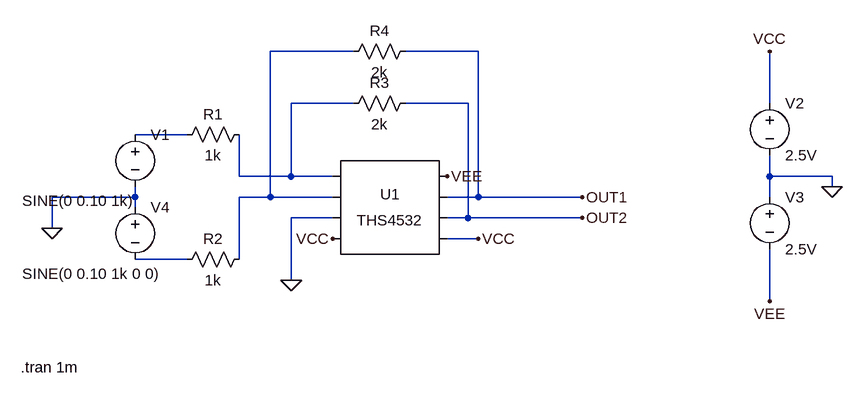
[diagram p0: schematic THS4532_test.asc]
THS4532_test.asc, the LTspice schematic file:
Version 4
SHEET 1 880 680
WIRE 112 -64 -16 -64
WIRE 304 -64 192 -64
WIRE 112 16 16 16
WIRE 288 16 192 16
WIRE 752 16 752 -64
WIRE -144 64 -224 64
WIRE -64 128 -64 64
WIRE 16 128 16 16
WIRE 16 128 -64 128
WIRE 80 128 16 128
WIRE 752 128 752 96
WIRE 848 128 752 128
WIRE 848 144 848 128
WIRE -224 160 -224 144
WIRE -224 160 -352 160
WIRE -16 160 -16 -64
WIRE -16 160 -64 160
WIRE 80 160 -16 160
WIRE 304 160 304 -64
WIRE 304 160 256 160
WIRE 464 160 304 160
WIRE 752 160 752 128
WIRE -224 176 -224 160
WIRE 80 192 16 192
WIRE 288 192 288 16
WIRE 288 192 256 192
WIRE 464 192 288 192
WIRE -352 208 -352 160
WIRE 304 224 256 224
WIRE -144 256 -224 256
WIRE -64 256 -64 160
WIRE 16 288 16 192
WIRE 752 320 752 240
FLAG 848 144 0
FLAG 752 320 VEE
FLAG 256 128 VEE
FLAG 752 -64 VCC
FLAG 80 224 VCC
FLAG 464 160 OUT1
FLAG 464 192 OUT2
FLAG -352 208 0
FLAG 16 288 0
FLAG 304 224 VCC
SYMBOL AutoGenerated\\THS4532 160 176 R0
SYMATTR InstName U1
SYMBOL res -48 48 R90
WINDOW 0 0 56 VBottom 2
WINDOW 3 32 56 VTop 2
SYMATTR InstName R1
SYMATTR Value 1k
SYMBOL res -48 240 R90
WINDOW 0 0 56 VBottom 2
WINDOW 3 32 56 VTop 2
SYMATTR InstName R2
SYMATTR Value 1k
SYMBOL res 208 0 R90
WINDOW 0 0 56 VBottom 2
WINDOW 3 32 56 VTop 2
SYMATTR InstName R3
SYMATTR Value 2k
SYMBOL res 208 -80 R90
WINDOW 0 0 56 VBottom 2
WINDOW 3 32 56 VTop 2
SYMATTR InstName R4
SYMATTR Value 2k
SYMBOL voltage 752 0 R0
WINDOW 123 0 0 Left 2
WINDOW 39 0 0 Left 2
SYMATTR InstName V2
SYMATTR Value 2.5V
SYMBOL voltage 752 144 R0
SYMATTR InstName V3
SYMATTR Value 2.5V
SYMBOL voltage -224 48 R0
WINDOW 3 -174 118 Left 2
WINDOW 123 0 0 Left 2
WINDOW 39 0 0 Left 2
SYMATTR InstName V1
SYMATTR Value SINE(0 0.10 1k)
SYMBOL voltage -224 160 R0
WINDOW 3 -174 118 Left 2
WINDOW 123 0 0 Left 2
WINDOW 39 0 0 Left 2
SYMATTR InstName V4
SYMATTR Value SINE(0 0.10 1k 0 0)
TEXT -400 422 Left 2 !.tran 1m

The netlist it stands for:
* THS4532_test.asc
* U1: THS4532 (symbol AutoGenerated\THS4532 not available, pins judged from their places): pin1=N002 pin2=N001 pin3=0 pin4=VCC pin5=VEE pin6=OUT1 pin7=OUT2 pin8=VCC
R1 N002 N003 1k
R2 N001 N004 1k
R3 OUT2 N002 2k
R4 OUT1 N001 2k
V2 VCC 0 2.5V
V3 0 VEE 2.5V
V1 N003 0 SINE(0 0.10 1k)
V4 0 N004 SINE(0 0.10 1k 0 0)
.tran 1m
.backanno
.end